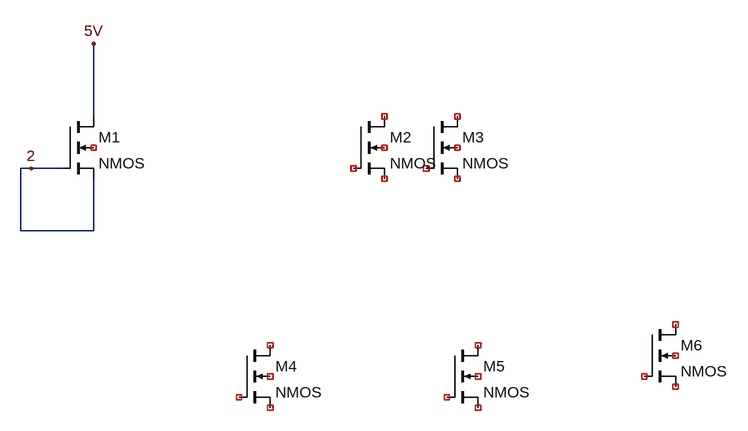
[diagram p0: schematic BUF.asc]
BUF.asc, the LTspice schematic file:
Version 4
SHEET 1 880 680
WIRE -144 112 -144 0
WIRE -240 192 -256 192
WIRE -192 192 -240 192
WIRE -256 288 -256 192
WIRE -144 288 -144 208
WIRE -144 288 -256 288
FLAG -144 0 5V
FLAG -240 192 2
SYMBOL nmos4 -192 112 R0
SYMATTR InstName M1
SYMBOL nmos4 256 112 R0
SYMATTR InstName M2
SYMBOL nmos4 368 112 R0
SYMATTR InstName M3
SYMBOL nmos4 80 464 R0
SYMATTR InstName M4
SYMBOL nmos4 400 464 R0
SYMATTR InstName M5
SYMBOL nmos4 704 432 R0
SYMATTR InstName M6

The netlist it stands for:
* BUF.asc
M1 5V 2 2 NC_01 NMOS
M2 NC_02 NC_03 NC_04 NC_05 NMOS
M3 NC_06 NC_07 NC_08 NC_09 NMOS
M4 NC_10 NC_11 NC_12 NC_13 NMOS
M5 NC_14 NC_15 NC_16 NC_17 NMOS
M6 NC_18 NC_19 NC_20 NC_21 NMOS
.model NMOS NMOS
.model PMOS PMOS
.lib standard.mos
.backanno
.end